# EAGLE schematic preScale-Mb501 (EAGLE 5.07)
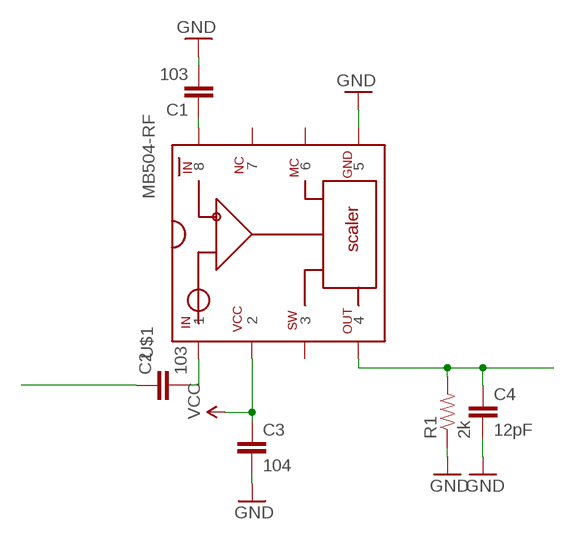
[diagram p0: schematic, sheet 1]

## Parts
C1  103  CAP-RF  [CAP-SMD-SMALL]
C2  103  CAP-RF  [CAP-SMD-SMALL]
C3  104  CAP-RF  [CAP-SMD-SMALL]
C4  12pF  CAP-RF  [CAP-SMD-SMALL]
R1  2k  RESISTOR1/4W-RF  [AXIAL-0.3-SMD]
U$1  MB504-RF  [DIP8-RF]

## Nets
GND: C1.P$2 C3.P$2 C4.P$2 R1.P$1 U$1.P$5
N$1: C1.P$1 U$1.P$8
N$2: C2.P$2 U$1.P$1
N$3: C2.P$1
N$4: C4.P$1 R1.P$2 U$1.P$4
VCC: C3.P$1 U$1.P$2
Unconnected: U$1.P$3 U$1.P$6 U$1.P$7

## Library data of the parts
C1-C4 = digital-toy:CAP: Capacitor Standard 0603 ceramic capacitor, and 0.1" leaded capacitor.
R1 = digital-toy:RESISTOR: Resistor Basic schematic elements and footprints for 0603, 1206, and PTH 1/10th watt (small) resistors. digital-toy copy vertical mount of axial-0.3 from rcl.lbr : the 0207/xx
U$1 = dtoy-RF:MB504: MB501/504 by hyl 2011.4.8